# Altium schematic sheet FPGA_POWER.SchDoc (part 1 of 3)
size A3; Organization: ICNS, MARCS Institute; Address1: Werrington South Campus, Great Western Highway; Address2: Werrington, NSW, 2747; SheetNumber: 2; SheetTotal: 16
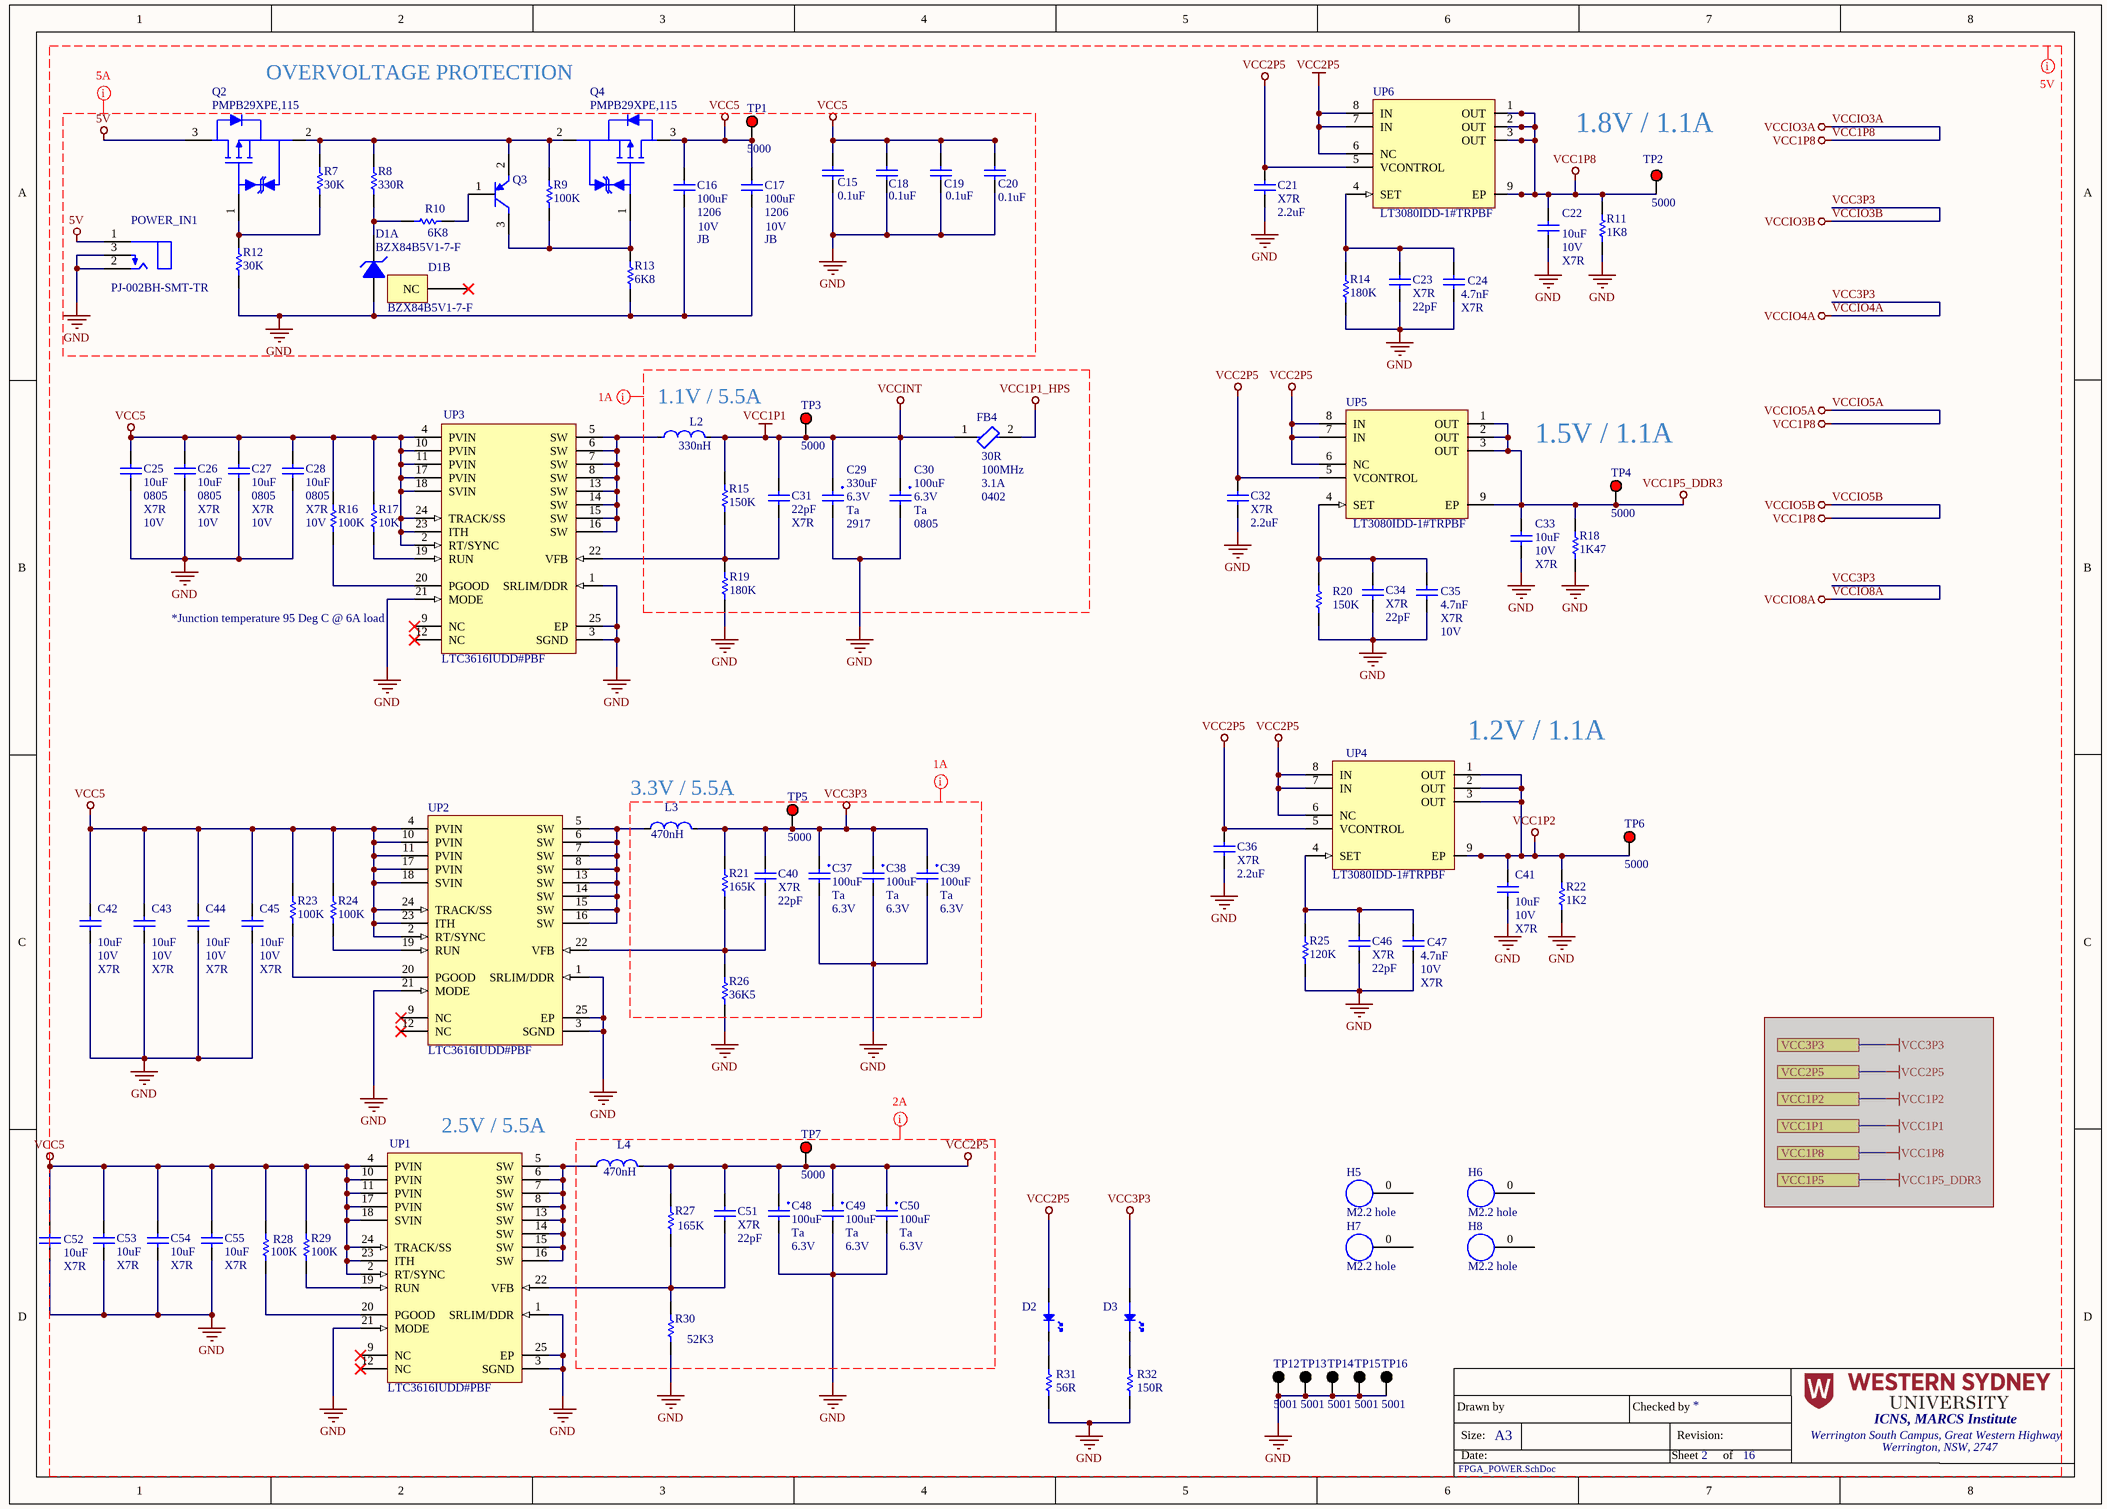
[diagram p0: FPGA_POWER.SchDoc]

## Parts
C15  value 0.1uF  [CAP 0402 (1005)]  (hidden comment: C0402C104M8RACTU)
C16  value 100uF  Case/Package: 1206  Voltage Rating: 10V  Dielectric: JB  [FP-C3216-160-0_3-IPC_A]  (hidden comment: C3216JB1A107M160AC)
C17  value 100uF  Case/Package: 1206  Voltage Rating: 10V  Dielectric: JB  [FP-C3216-160-0_3-IPC_A]  (hidden comment: C3216JB1A107M160AC)
C18  value 0.1uF  [CAP 0402 (1005)]  (hidden comment: C0402C104M8RACTU)
C19  value 0.1uF  [CAP 0402 (1005)]  (hidden comment: C0402C104M8RACTU)
C20  value 0.1uF  [CAP 0402 (1005)]  (hidden comment: C0402C104M8RACTU)
C21  Dielectric: X7R  Capacitance: 2.2uF  [CAP 0402 (1005)]  (hidden comment: GRM155Z71A225KE01D)
C22  value 10uF  Dielectric: X7R  Voltage Rating: 10V  [CAP 0805 (2012)]  (hidden comment: GCM21BR71A106KE22K)
C23  value 22pF  Dielectric: X7R  [CAP 0402 (1005)]  (hidden comment: C0402C220K5RACTU)
C24  value 4.7nF  Dielectric: X7R  [CAP 0402 (1005)]  (hidden comment: LMF105B7472KVHF)
C25  value 10uF  Case Code (Imperial): 0805  Dielectric: X7R  Voltage Rating: 10V  [CAP 0805 (2012)]  (hidden comment: GCM21BR71A106KE22K)
C26  value 10uF  Case Code (Imperial): 0805  Dielectric: X7R  Voltage Rating: 10V  [CAP 0805 (2012)]  (hidden comment: GCM21BR71A106KE22K)
C27  value 10uF  Case Code (Imperial): 0805  Dielectric: X7R  Voltage Rating: 10V  [CAP 0805 (2012)]  (hidden comment: GCM21BR71A106KE22K)
C28  value 10uF  Case Code (Imperial): 0805  Dielectric: X7R  Voltage Rating: 10V  [CAP 0805 (2012)]  (hidden comment: GCM21BR71A106KE22K)
C29  value 330uF  Case Code (Imperial): 2917  Dielectric: Ta  Voltage Rating: 6.3V  [CAPMP7343X31N]  (hidden comment: T495D337K006ATE100)
C30  value 100uF  Case Code (Imperial): 0805  Voltage Rating: 6.3V  Dielectric: Ta  [CAPCP 0805 (2012)]  (hidden comment: TLCR107M006RTA)
C31  value 22pF  Dielectric: X7R  [CAP 0402 (1005)]  (hidden comment: C0402C220K5RACTU)
C32  Dielectric: X7R  Capacitance: 2.2uF  [CAP 0402 (1005)]  (hidden comment: GRM155Z71A225KE01D)
C33  value 10uF  Dielectric: X7R  Voltage Rating: 10V  [CAP 0805 (2012)]  (hidden comment: GCM21BR71A106KE22K)
C34  value 22pF  Dielectric: X7R  [CAP 0402 (1005)]  (hidden comment: C0402C220K5RACTU)
C35  value 4.7nF  Dielectric: X7R  Voltage Rating: 10V  [CAP 0402 (1005)]  (hidden comment: LMF105B7472KVHF)
C36  Dielectric: X7R  Capacitance: 2.2uF  [CAP 0402 (1005)]  (hidden comment: GRM155Z71A225KE01D)
C37  value 100uF  Dielectric: Ta  Voltage Rating: 6.3V  [CAPCP 0805 (2012)]  (hidden comment: TLCR107M006RTA)
C38  value 100uF  Dielectric: Ta  Voltage Rating: 6.3V  [CAPCP 0805 (2012)]  (hidden comment: TLCR107M006RTA)
C39  value 100uF  Dielectric: Ta  Voltage Rating: 6.3V  [CAPCP 0805 (2012)]  (hidden comment: TLCR107M006RTA)
C40  value 22pF  Dielectric: X7R  [CAP 0402 (1005)]  (hidden comment: C0402C220K5RACTU)
C41  value 10uF  Dielectric: X7R  Voltage Rating: 10V  [CAP 0805 (2012)]  (hidden comment: GCM21BR71A106KE22K)
C42  value 10uF  Dielectric: X7R  Voltage Rating: 10V  [CAP 0805 (2012)]  (hidden comment: GCM21BR71A106KE22K)
C43  value 10uF  Dielectric: X7R  Voltage Rating: 10V  [CAP 0805 (2012)]  (hidden comment: GCM21BR71A106KE22K)
C44  value 10uF  Dielectric: X7R  Voltage Rating: 10V  [CAP 0805 (2012)]  (hidden comment: GCM21BR71A106KE22K)
C45  value 10uF  Dielectric: X7R  Voltage Rating: 10V  [CAP 0805 (2012)]  (hidden comment: GCM21BR71A106KE22K)
C46  value 22pF  Dielectric: X7R  [CAP 0402 (1005)]  (hidden comment: C0402C220K5RACTU)
C47  value 4.7nF  Dielectric: X7R  Voltage Rating: 10V  [CAP 0402 (1005)]  (hidden comment: LMF105B7472KVHF)
C48  value 100uF  Dielectric: Ta  Voltage Rating: 6.3V  [CAPCP 0805 (2012)]  (hidden comment: TLCR107M006RTA)
C49  value 100uF  Dielectric: Ta  Voltage Rating: 6.3V  [CAPCP 0805 (2012)]  (hidden comment: TLCR107M006RTA)
C50  value 100uF  Dielectric: Ta  Voltage Rating: 6.3V  [CAPCP 0805 (2012)]  (hidden comment: TLCR107M006RTA)
C51  value 22pF  Dielectric: X7R  [CAP 0402 (1005)]  (hidden comment: C0402C220K5RACTU)
C52  value 10uF  Dielectric: X7R  [CAP 0805 (2012)]  (hidden comment: GCM21BR71A106KE22K)
C53  value 10uF  Dielectric: X7R  [CAP 0805 (2012)]  (hidden comment: GCM21BR71A106KE22K)
C54  value 10uF  Dielectric: X7R  [CAP 0805 (2012)]  (hidden comment: GCM21BR71A106KE22K)
C55  value 10uF  Dielectric: X7R  [CAP 0805 (2012)]  (hidden comment: GCM21BR71A106KE22K)
D1  BZX84B5V1-7-F  [FP-SOT23-IPC_A]  (parts A,B of 2)
D2  150060SS75000  [DIOC 0603 (1608)]  (value not drawn)
D3  150060SS75000  [DIOC 0603 (1608)]  (value not drawn)
FB4  Test Frequency: 100MHz  Impedance: 30R  Case Code (Imperial): 0402  Max Current Rating: 3.1A  [FP-BLM15-0_05-d1_2-IPC_A]  (hidden comment: BLM15KD300SN1D)
H5  M2.2 hole  [M2.2 hole]  (no BOM)
H6  M2.2 hole  [M2.2 hole]  (no BOM)
H7  M2.2 hole  [M2.2 hole]  (no BOM)
H8  M2.2 hole  [M2.2 hole]  (no BOM)
L2  value 330nH  [FP-IHLP-2525CZ-FP_2_413x3-MFG]  (hidden comment: IHLP2525CZERR33M01)
L3  value 470nH  [INDM6965X30N]  (hidden comment: IHLP2525CZETR47M01)
L4  value 470nH  [INDM6965X30N]  (hidden comment: IHLP2525CZETR47M01)
POWER_IN1  PJ-002BH-SMT-TR  [FP-PJ-002BH-SMT-TR-MFG]
Q2  PMPB29XPE,115  [DFN2020MD-6]
Q3  CMP-007-000000-1  [FP-SOT23-IPC_A]  (value not drawn)
Q4  PMPB29XPE,115  [DFN2020MD-6]
R7  value 30K  [RES 0402 (1005)]  (hidden comment: RCS040230K0FKED)
R8  value 330R  [RES 0402 (1005)]  (hidden comment: CRCW0402330RFKEDHP)
R9  value 100K  [RES 0402 (1005)]  (hidden comment: CRCW0402100KFKEDHP)
R10  value 6K8  [RES 0402 (1005)]  (hidden comment: CRCW04026K80FKEDHP)
R11  value 1K8  [RES 0402 (1005)]  (hidden comment: CRCW04021K80FKEDHP)
R12  value 30K  [RES 0402 (1005)]  (hidden comment: RCS040230K0FKED)
R13  value 6K8  [RES 0402 (1005)]  (hidden comment: CRCW04026K80FKEDHP)
R14  value 180K  [RES 0402 (1005)]  (hidden comment: RCS0402180KFKED)
R15  value 150K  [RES 0402 (1005)]  (hidden comment: CRCW0402150KFKED)
R16  value 100K  [RES 0402 (1005)]  (hidden comment: CRCW0402100KFKEDHP)
R17  value 10K  [RES 0402 (1005)]  (hidden comment: RCS040210K0FKED)
R18  value 1K47  [RES 0402 (1005)]  (hidden comment: CRCW04021K47FKED)
R19  value 180K  [RES 0402 (1005)]  (hidden comment: RCS0402180KFKED)
R20  value 150K  [RES 0402 (1005)]  (hidden comment: CRCW0402150KFKED)
R21  value 165K  [RES 0402 (1005)]  (hidden comment: RC0402FR-07165KL)
R22  value 1K2  [RES 0402 (1005)]  (hidden comment: CRCW04021K20FKEDHP)
R23  value 100K  [RES 0402 (1005)]  (hidden comment: CRCW0402100KFKEDHP)
R24  value 100K  [RES 0402 (1005)]  (hidden comment: CRCW0402100KFKEDHP)
R25  value 120K  [RES 0402 (1005)]  (hidden comment: CRCW0402120KFKEDHP)
R26  value 36K5  [RES 0402 (1005)]  (hidden comment: AC0402FR-0736K5L)
R27  value 165K  [RES 0402 (1005)]  (hidden comment: RC0402FR-07165KL)
R28  value 100K  [RES 0402 (1005)]  (hidden comment: CRCW0402100KFKEDHP)
R29  value 100K  [RES 0402 (1005)]  (hidden comment: CRCW0402100KFKEDHP)
R30  value 52K3  [RES 0402 (1005)]  (hidden comment: RCS040252K3FKED)
R31  value 56R  [RES 0603 (1608)]  (hidden comment: ERJH3EF56R0V)
R32  value 150R  [RES 0603 (1608)]  (hidden comment: AC0603FR-10150RL)
TP1  5000  [FP-5000-MFG]
TP2  5000  [FP-5000-MFG]
TP3  5000  [FP-5000-MFG]
TP4  5000  [FP-5000-MFG]
TP5  5000  [FP-5000-MFG]
TP6  5000  [FP-5000-MFG]
TP7  5000  [FP-5000-MFG]
TP12  5001  [FP-5001-MFG]
TP13  5001  [FP-5001-MFG]
TP14  5001  [FP-5001-MFG]
TP15  5001  [FP-5001-MFG]
TP16  5001  [FP-5001-MFG]
UP1  LTC3616IUDD#PBF  [LT-UDD-24_N]
UP2  LTC3616IUDD#PBF  [LT-UDD-24_N]
UP3  LTC3616IUDD#PBF  [LT-UDD-24_N]
UP4  LT3080IDD-1#TRPBF  [LT-DD-8_V]
UP5  LT3080IDD-1#TRPBF  [LT-DD-8_V]
UP6  LT3080IDD-1#TRPBF  [LT-DD-8_V]

## Ports
VCC1P1, VCC1P2, VCC1P5, VCC1P8, VCC2P5, VCC3P3

## Nets
5V: POWER_IN1.1 Q2.3(D)
GND: C15.2 C16.2 C17.2 C18.2 C19.2 C20.2 C21.2 C22.1 C23.2 C24.2 C25.2 C26.2 C27.2 C28.2 C29.2 C30.2 C32.2 C33.1 C34.2 C35.2 C36.2 C37.2 C38.2 C39.2 C41.1 C42.2 C43.1 C44.1 C45.1 C46.2 C47.2 C48.2 C49.2 C50.2 C52.2 C53.2 C54.2 C55.1 D1.1(A) POWER_IN1.2 POWER_IN1.3 R11.2 R12.2 R13.2 R14.2 R18.2 R19.2 R20.1 R22.2 R25.2 R26.2 R30.2 R31.2 R32.2 TP12.1 TP13.1 TP14.1 TP15.1 TP16.1 UP1.1(SRLIM/DDR) UP1.3(SGND) UP1.21(MODE) UP1.25(EP) UP2.1(SRLIM/DDR) UP2.3(SGND) UP2.21(MODE) UP2.25(EP) UP3.1(SRLIM/DDR) UP3.3(SGND) UP3.21(MODE) UP3.25(EP)
VCC1P1: C29.1 C30.1 C31.1 FB4.1 L2.2 R15.1 TP3.1  [also labelled VCCINT]
VCC1P1_HPS: FB4.2
VCC1P2: C41.2 R22.1 TP6.1 UP4.1(OUT) UP4.2(OUT) UP4.3(OUT) UP4.9(EP)
VCC1P5_DDR3: C33.2 R18.1 TP4.1 UP5.1(OUT) UP5.2(OUT) UP5.3(OUT) UP5.9(EP)
VCC1P8: C22.2 R11.1 TP2.1 UP6.1(OUT) UP6.2(OUT) UP6.3(OUT) UP6.9(EP)  [also labelled VCCIO3A, VCCIO5A, VCCIO5B]
VCC2P5: C21.1 C32.1 C36.1 C48.1 C49.1 C50.1 C51.1 D2.2(A) L4.2 R27.1 TP7.1 UP4.5(VCONTROL) UP4.6(NC) UP4.7(IN) UP4.8(IN) UP5.5(VCONTROL) UP5.6(NC) UP5.7(IN) UP5.8(IN) UP6.5(VCONTROL) UP6.6(NC) UP6.7(IN) UP6.8(IN)
VCC3P3: C37.1 C38.1 C39.1 C40.1 D3.2(A) L3.2 R21.1 TP5.1  [also labelled VCCIO3B, VCCIO4A, VCCIO8A]
VCC5: C15.1 C16.1 C17.1 C18.1 C19.1 C20.1 C25.1 C26.1 C27.1 C28.1 C42.1 C43.2 C44.2 C45.2 C52.1 C53.1 C54.1 C55.2 Q4.3(D) R16.2 R17.2 R23.2 R24.2 R28.2 R29.2 TP1.1 UP1.2(RT/SYNC) UP1.4(PVIN) UP1.10(PVIN) UP1.11(PVIN) UP1.17(PVIN) UP1.18(SVIN) UP1.23(ITH) UP1.24(TRACK/SS) UP2.2(RT/SYNC) UP2.4(PVIN) UP2.10(PVIN) UP2.11(PVIN) UP2.17(PVIN) UP2.18(SVIN) UP2.23(ITH) UP2.24(TRACK/SS) UP3.2(RT/SYNC) UP3.4(PVIN) UP3.10(PVIN) UP3.11(PVIN) UP3.17(PVIN) UP3.18(SVIN) UP3.23(ITH) UP3.24(TRACK/SS)
NetC23_1: C23.1 C24.1 R14.1 UP6.4(SET)
NetC31_2: C31.2 R15.2 R19.1 UP3.22(VFB)
NetC34_1: C34.1 C35.1 R20.2 UP5.4(SET)
NetC40_2: C40.2 R21.2 R26.1 UP2.22(VFB)
NetC46_1: C46.1 C47.1 R25.1 UP4.4(SET)
NetC51_2: C51.2 R27.2 R30.1 UP1.22(VFB)
NetD1_3: D1.3(K) R8.2 R10.1
NetD2_1: D2.1(K) R31.1
NetD3_1: D3.1(K) R32.1
NetL2_1: L2.1 UP3.5(SW) UP3.6(SW) UP3.7(SW) UP3.8(SW) UP3.13(SW) UP3.14(SW) UP3.15(SW) UP3.16(SW)
NetL3_1: L3.1 UP2.5(SW) UP2.6(SW) UP2.7(SW) UP2.8(SW) UP2.13(SW) UP2.14(SW) UP2.15(SW) UP2.16(SW)
NetL4_1: L4.1 UP1.5(SW) UP1.6(SW) UP1.7(SW) UP1.8(SW) UP1.13(SW) UP1.14(SW) UP1.15(SW) UP1.16(SW)
NetQ2_1: Q2.1(G) R7.2 R12.1
NetQ2_2: Q2.2(S) Q3.2(E) Q4.2(S) R7.1 R8.1 R9.1
NetQ3_1: Q3.1(B) R10.2
NetQ3_3: Q3.3(C) Q4.1(G) R9.2 R13.1
NetR16_1: R16.1 UP3.20(PGOOD)
NetR17_1: R17.1 UP3.19(RUN)
NetR23_1: R23.1 UP2.20(PGOOD)
NetR24_1: R24.1 UP2.19(RUN)
NetR28_1: R28.1 UP1.20(PGOOD)
NetR29_1: R29.1 UP1.19(RUN)

Not connected (* = marked no-connect by the designer): D1 2(NC)*; H5 0; H6 0; H7 0; H8 0; UP1 9(NC)* 12(NC)*; UP2 9(NC)* 12(NC)*; UP3 9(NC)* 12(NC)*

## Layout directives
net class 5V: 5V, GND, VCC1P1, VCC1P1_HPS, VCC1P2, VCC1P5_DDR3, VCC1P8, VCC2P5, VCC3P3, VCC5, VCCINT, VCCIO3A, VCCIO3B, VCCIO4A, VCCIO5A, VCCIO5B, VCCIO8A
net class 5A: 5V, GND, VCC5
net class 1A: VCC1P1, VCC1P1_HPS, VCC3P3, VCCINT
net class 2A: VCC2P5

## Notes on the sheet
- OVERVOLTAGE PROTECTION
- (near TP2) 1.8V / 1.1A
- 1.1V / 5.5A
- (near TP4) 1.5V / 1.1A
- (near UP3) *Junction temperature 95 Deg C @ 6A load
- (near UP4) 1.2V / 1.1A
- 3.3V / 5.5A
- 2.5V / 5.5A
- Drawn by
- Size:
- Date:
- A3
- Checked by
- Sheet
- Revision:
- of